# EasyEDA Pro project ProPrj_usb_hub_v2_2026-04-01.epro

# Schematic usb_hub
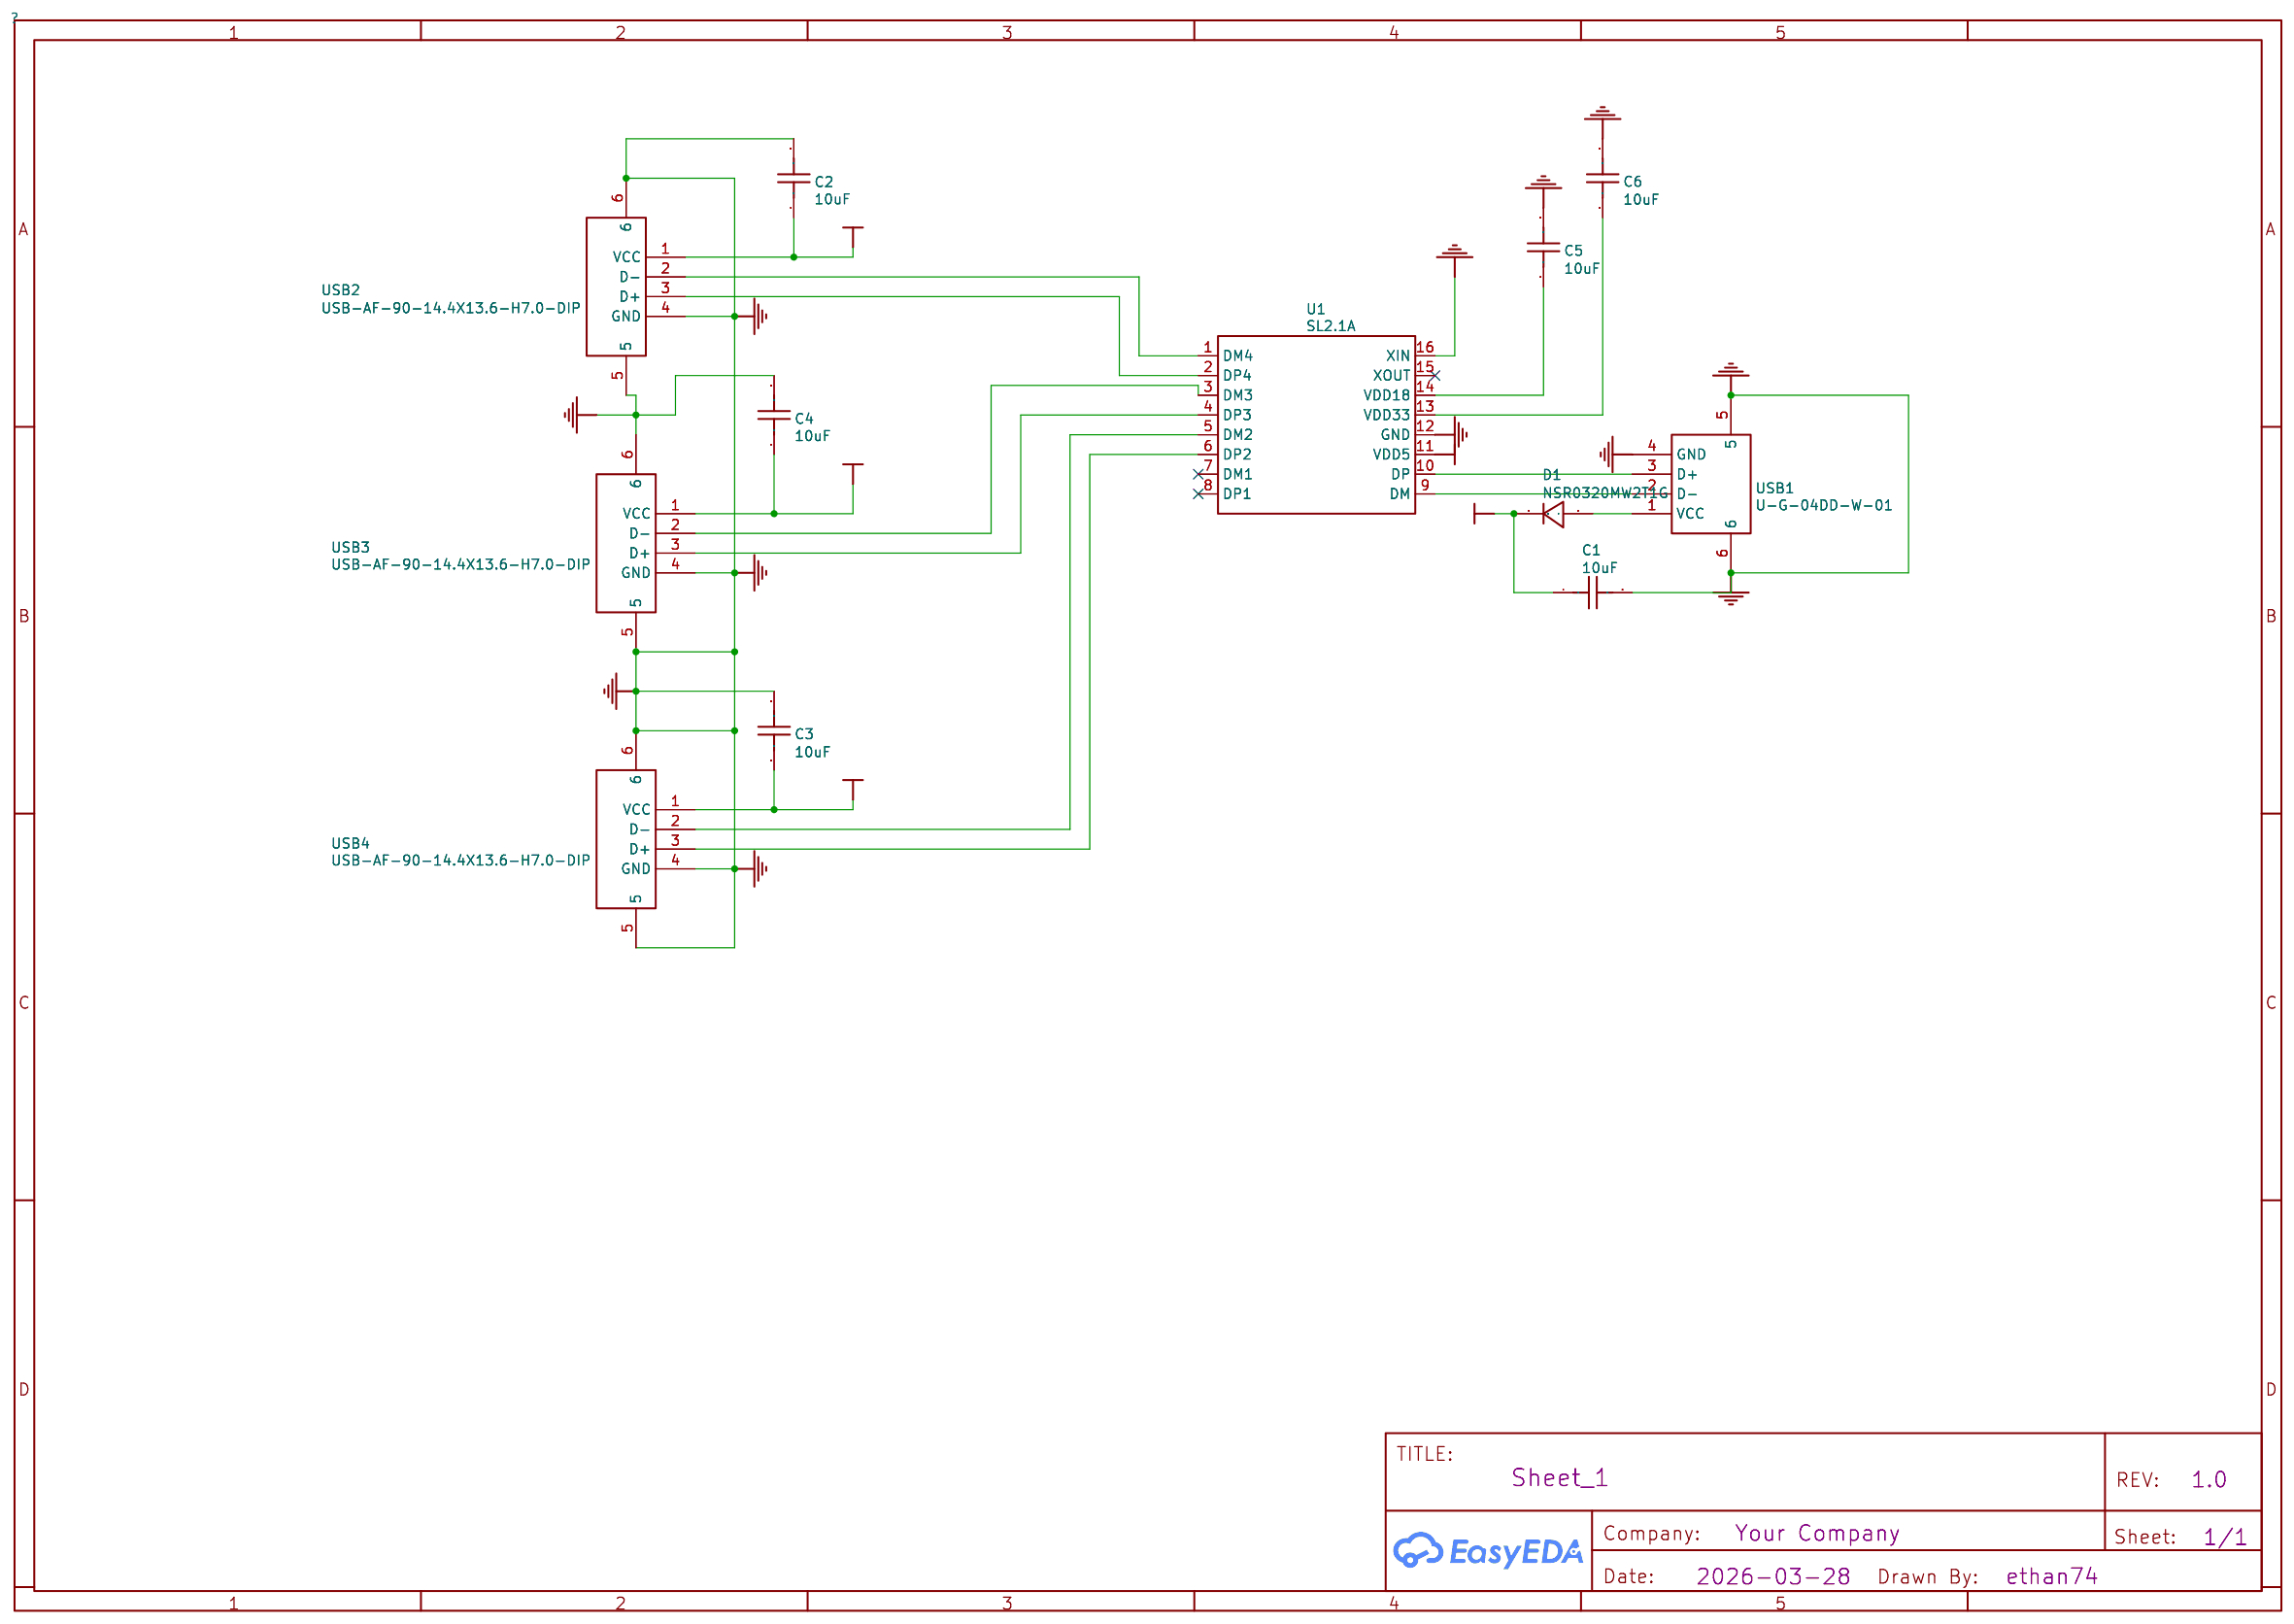
[diagram p0: schematic sheet]

## Parts
C1  10uF  [C0603]
C2  10uF  [C0603]
C3  10uF  [C0603]
C4  10uF  [C0603]
C5  10uF  [C0603]
C6  10uF  [C0603]
D1  NSR0320MW2T1G  [SOD-323_L1.8-W1.3-LS2.5-RD]
U1  SL2.1A  [SOP-16_L10.0-W3.9-P1.27-LS6.0-BL]
USB1  U-G-04DD-W-01  [USB-A-TH_U-G-04WD-W-01]
USB2  USB-AF-90-14.4X13.6-H7.0-DIP  [USB-A-TH_C46407]
USB3  USB-AF-90-14.4X13.6-H7.0-DIP  [USB-A-TH_C46407]
USB4  USB-AF-90-14.4X13.6-H7.0-DIP  [USB-A-TH_C46407]

## Library data of the parts
C1-C6 = 10uF: Supplier: LCSC; Manufacturer: SAMSUNG(三星); Manufacturer Part: CL10A106KP8NNNC; Supplier Part: C19702; JLCPCB Part Class: Basic Part; nameAlias: Value; spicePre: C; spiceSymbolName: CL10A106KP8NNNC
D1 = NSR0320MW2T1G: Supplier: LCSC; Manufacturer: onsemi(安森美); Supplier Part: C48192; JLCPCB Part Class: Extended Part; spicePre: D
U1 = SL2.1A: Supplier Part: C192893; Supplier: LCSC; Manufacturer: CoreChips(和芯润德); JLCPCB Part Class: Extended Part; Contributor: LCSC; spicePre: U
USB1 = U-G-04DD-W-01: Supplier: LCSC; Manufacturer: 韩国韩荣; Manufacturer Part: U-G-O4DD-W-1; Supplier Part: C98125; JLCPCB Part Class: Extended Part; spicePre: U
USB2-USB4 = USB-AF-90-14.4X13.6-H7.0-DIP: Supplier: LCSC; Supplier Part: C46407; Manufacturer: 精拓金; Manufacturer Part: 903-131A1011D10100; JLCPCB Part Class: Extended Part; Contributor: LCSC; spicePre: U

## Nets
+5V: C1.1 C2.1 C3.1 C4.1 D1.1(C) U1.11(VDD5) USB2.1(VCC) USB3.1(VCC) USB4.1(VCC)
GND: C1.2 C2.2 C3.2 C4.2 C5.2 C6.2 U1.12(GND) U1.16(XIN) USB1.4(GND) USB1.5 USB1.6 USB2.4(GND) USB2.5 USB2.6 USB3.4(GND) USB3.5 USB3.6 USB4.4(GND) USB4.5 USB4.6
U1_5: U1.5(DM2) USB4.2(D-)
U1_6: U1.6(DP2) USB4.3(D+)
U1_13: C6.1 U1.13(VDD33)
U1_14: C5.1 U1.14(VDD18)
USB1_1: D1.2(A) USB1.1(VCC)
USB1_2: U1.9(DM) USB1.2(D-)
USB1_3: U1.10(DP) USB1.3(D+)
USB2_2: U1.1(DM4) USB2.2(D-)
USB2_3: U1.2(DP4) USB2.3(D+)
USB3_2: U1.3(DM3) USB3.2(D-)
USB3_3: U1.4(DP3) USB3.3(D+)

Not connected (* = marked no-connect by the designer): U1 7(DM1)* 8(DP1)* 15(XOUT)*

# Board PCB_usb_hub
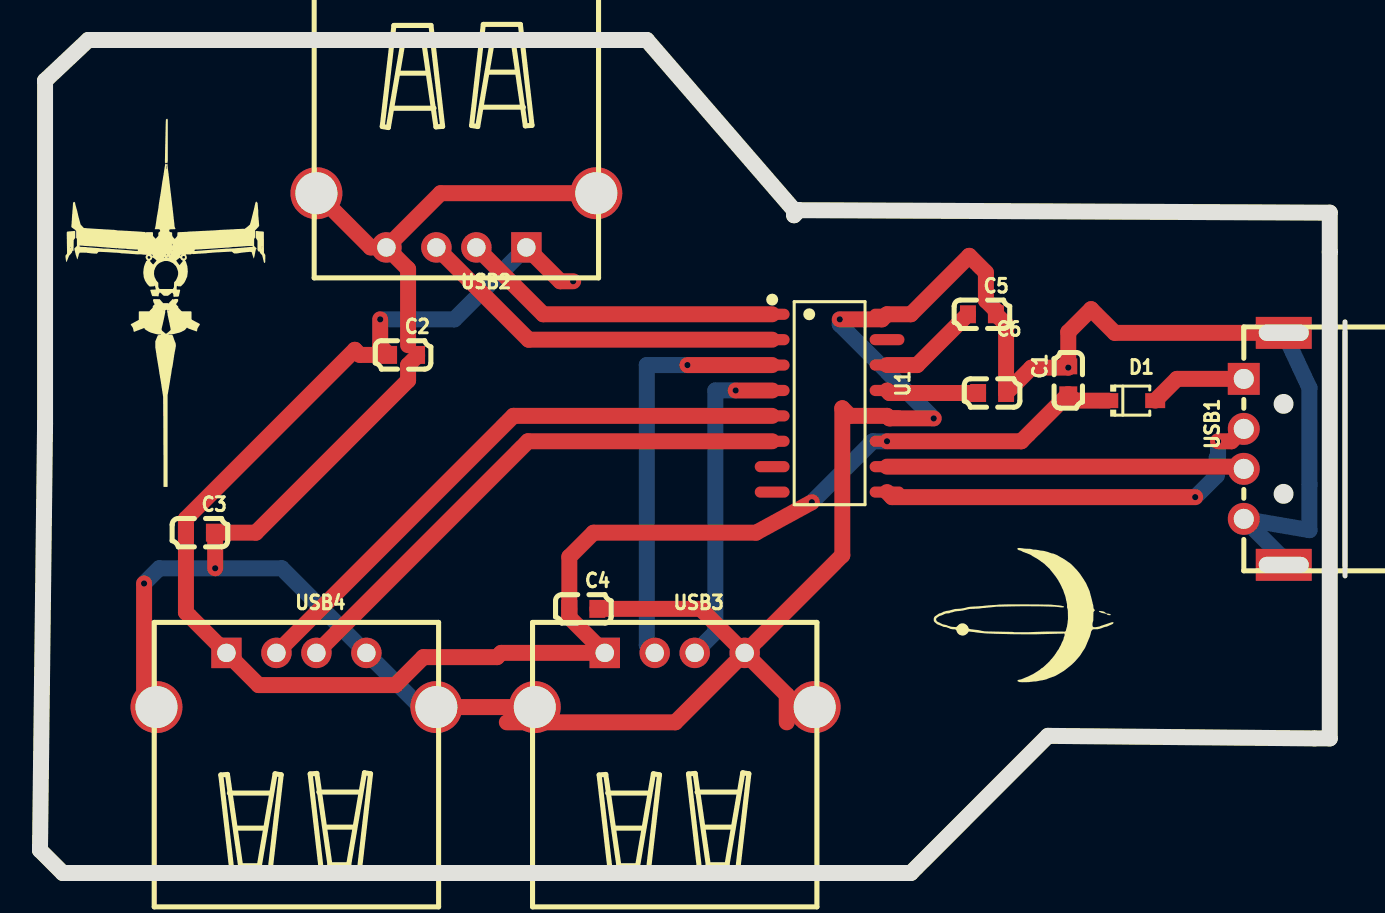
[diagram p1: board, top side]
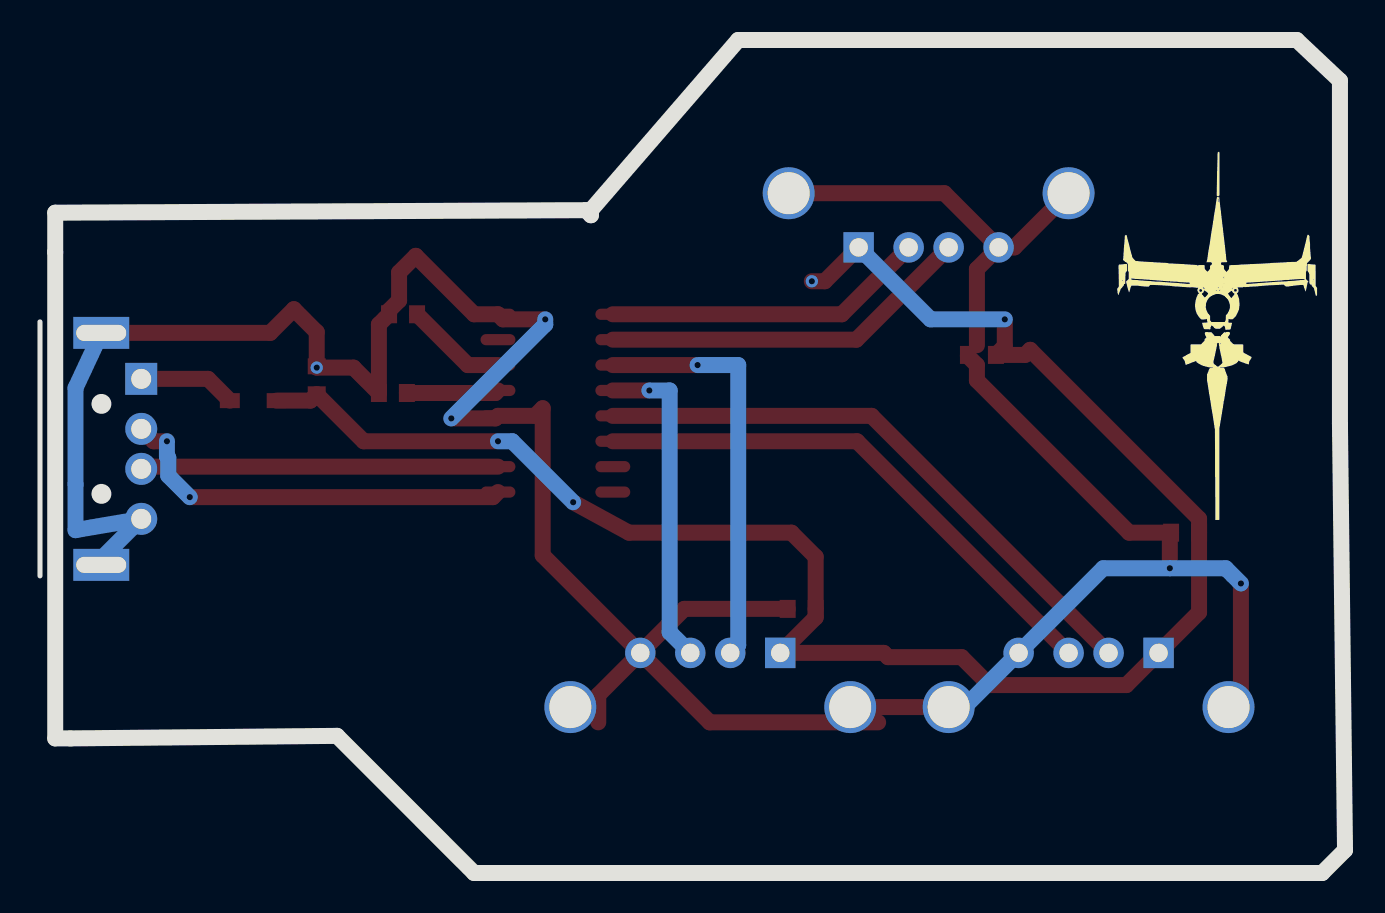
[diagram p2: board, bottom side, seen from below]

Outline 65.28 x 41.66 mm; copper layers: Top Layer, Bottom Layer. Coordinates in mm from the lower left corner of the outline.
Outline path: 0,1.14 0.25,22.48 0.25,39.62 2.41,41.66 30.35,41.66 37.72,33.15 37.72,32.89 37.97,33.15 64.52,33.02 64.52,6.73 63.75,6.73 50.42,6.86 43.56,0 1.14,0 0,1.14
Stack: Top Layer 0.035mm / Dielectric1 1.51mm FR4 er 4.5 / Bottom Layer 0.035mm

## Design rules (mm)
spacing Default (default): track to track 0.152, other pairs 0 to 0.152
track width Default (default): min 0.254, default 0.254, max 25.4
differential pair differentialPair (default): width min 0.127, default 0.254, max 2.54; gap min 0.152, default 0.152
via Default (default): diameter min 0.61, default 0.61, max 100.025; hole min 0.305, default 0.305, max 59.995

## Placement (name value [footprint] x y rotation side)
C1  10uF  [C0603]  51.43 24.64 90 top
C2  10uF  [C0603]  18.16 25.91 0 top
C3  10uF  [C0603]  8 17.02 0 top
C4  10uF  [C0603]  27.18 13.21 0 top
C5  10uF  [C0603]  47.12 27.94 0 top
C6  10uF  [C0603]  47.62 24 0 top
D1  NSR0320MW2T1G  [SOD-323_L1.8-W1.3-LS2.5-RD]  54.61 23.62 0 top
U1  SL2.1A  [SOP-16_L10.0-W3.9-P1.27-LS6.0-BL]  39.5 23.5 270 top
USB1  U-G-04DD-W-01  [USB-A-TH_U-G-04WD-W-01]  61.21 21.21 90 top
USB2  USB-AF-90-14.4X13.6-H7.0-DIP  [USB-A-TH_C46407]  20.83 32.64 180 top
USB3  USB-AF-90-14.4X13.6-H7.0-DIP  [USB-A-TH_C46407]  31.75 9.65 0 top
USB4  USB-AF-90-14.4X13.6-H7.0-DIP  [USB-A-TH_C46407]  12.83 9.65 0 top

## Footprints (pads in the part's own frame, mm; a bottom-side part is the same pattern mirrored in y, then rotated)
C0603
  rect 0.8x0.9 smd: 1(-0.7,0) 2(0.7,0)
SOD-323_L1.8-W1.3-LS2.5-RD
  rect 1x0.75 smd: 1(-1.173,0) 2(1.173,0)
SOP-16_L10.0-W3.9-P1.27-LS6.0-BL
  oval 0.56x1.745 smd: 1(-4.445,-2.873) 2(-3.175,-2.873) 3(-1.905,-2.873) 4(-0.635,-2.873) 5(0.635,-2.873) 6(1.905,-2.873) 7(3.175,-2.873) 8(4.445,-2.873) 9(4.445,2.873) 10(3.175,2.873) 11(1.905,2.873) 12(0.635,2.873) 13(-0.635,2.873) 14(-1.905,2.873) 15(-3.175,2.873) 16(-4.445,2.873)
USB-A-TH_C46407
  rect 1.524x1.524 hole 0.92: 1(-3.5,1.355)
  round 1.524 hole 0.92: 2(-1,1.355) 3(1,1.355) 4(3.5,1.355)
  round 2.6 hole 2.1: 5(7,-1.355) 6(-7,-1.355)
USB-A-TH_U-G-04WD-W-01
  rect 1.6x1.6 hole 1: 1(3.5,1)
  round 1.6 hole 1: 2(1,1) 3(-1,1) 4(-3.5,1)
  rect 1.6x2.8 hole 0.8x2.5: 5(5.8,-1) 6(-5.8,-1)

## Nets
As in the schematic.

Pads without a net: U1 7 8 15

## Via types
v1: diameter 0.62, hole 0.31, Top Layer to Bottom Layer, 13 vias

## Routing (per net, layer and track width the routed paths; a pad name or vN(x,y) marks a point on that pad's centre or on a via; arc(x,y) is an arc through that point)
+5V: length 91.1
  Top Layer w0.8: v1(17.02,27.69) 17.02,26.35 C2.1 16,25.91 15.75,26.16 7.3,17.72 C3.1 7.3,13.03 USB4.1 10.94,9.4 17.78,9.4 19.18,10.8 22.86,10.8 23.07,11.01 USB3.1 26.48,12.78 C4.1 26.48,15.81 27.69,17.02 35.81,17.02 v1(38.61,18.54) ; v1(26.67,29.59) 26.02,29.59 USB2.1 ; v1(42.37,21.59) 49.09,21.59 C1.1 51.75,23.62 D1.1
  Bottom Layer w0.8: v1(38.61,18.54) 41.66,21.59 v1(42.37,21.59) ; v1(17.02,27.69) 20.73,27.69 USB2.1
GND: length 168
  Top Layer w0.8: USB2.4 16.54,31.28 USB2.5 ; USB2.4 18.41,30.2 18.41,26.39 ; USB2.4 20.04,33.99 USB2.6 ; 19.83,8.3 USB3.6 ; USB3.4 40.13,15.89 40.13,23.24 40.51,22.86 U1.12 42.5,22.73 v1(44.7,22.73) ; USB3.4 33.05,13.21 C4.2 ; USB3.4 31.78,7.53 23.35,7.53 ; USB3.4 37.35,8.9 37.35,7.53 ; v1(40,27.69) 42.12,27.69 U1.16 43.56,27.94 46.48,30.86 47.31,30.03 47.31,28.63 47.82,28.13 C5.2 48.33,27.43 48.33,24 49.59,25.27 v1(51.43,25.27) 51.43,27.05 52.58,28.19 53.76,27.01 USB1.5 ; v1(5.21,14.48) 5.21,8.92 USB4.6 ; v1(8.76,15.24) 8.76,16.96 C3.2 10.79,17.02 18.41,24.64 18.41,25.4 18.86,25.85 18.86,25.91
  Bottom Layer w0.8: USB1.5 63.5,24.26 63.5,17.14 USB1.4 62.21,15.71 USB1.6 ; v1(5.21,14.48) 5.97,15.24 v1(8.76,15.24) 12.09,15.24 19.04,8.3 19.83,8.3 ; v1(40,27.69) 40,27.43 v1(44.7,22.73)
U1_5: length 29.7
  Top Layer w0.8: USB4.2 23.68,22.86 U1.5
U1_6: length 27.2
  Top Layer w0.8: U1.6 24.41,21.59 USB4.3
U1_13: length 4.6
  Top Layer w0.8: U1.13 42.5,24 C6.1
U1_14: length 5.1
  Top Layer w0.8: U1.14 43.88,25.4 C5.1
USB1_1: length 4.9
  Top Layer w0.8: USB1.1 56.87,24.71 D1.2
USB1_2: length 20.3
  Top Layer w0.8: USB1.2 59.59,21.59 v1(58.93,21.59) ; v1(57.78,18.8) 42.62,18.8 U1.9
  Bottom Layer w0.8: v1(57.78,18.8) 58.86,19.87 58.86,20.77 58.93,20.84 v1(58.93,21.59)
USB1_3: length 17.9
  Top Layer w0.8: U1.10 60.1,20.32 USB1.3
USB2_2: length 16.2
  Top Layer w0.8: U1.1 25.17,27.94 USB2.2
USB2_3: length 18.7
  Top Layer w0.8: USB2.3 24.44,26.67 U1.2
USB3_2: length 20.8
  Top Layer w0.8: U1.3 v1(32.39,25.4)
  Bottom Layer w0.8: v1(32.39,25.4) 30.35,25.4 30.35,11.4 USB3.2
USB3_3: length 16.4
  Top Layer w0.8: U1.4 v1(34.8,24.13)
  Bottom Layer w0.8: USB3.3 33.78,12.04 33.78,24.13 v1(34.8,24.13)
